# EasyEDA schematic ABCD_2020-09-23_12-41-30.json
TITLE: Sheet_1; REV: 1.2; Date: 2020-09-17; Sheet: 2/2; Drawn By: 刘宇帆; Company: 焊锡长隆
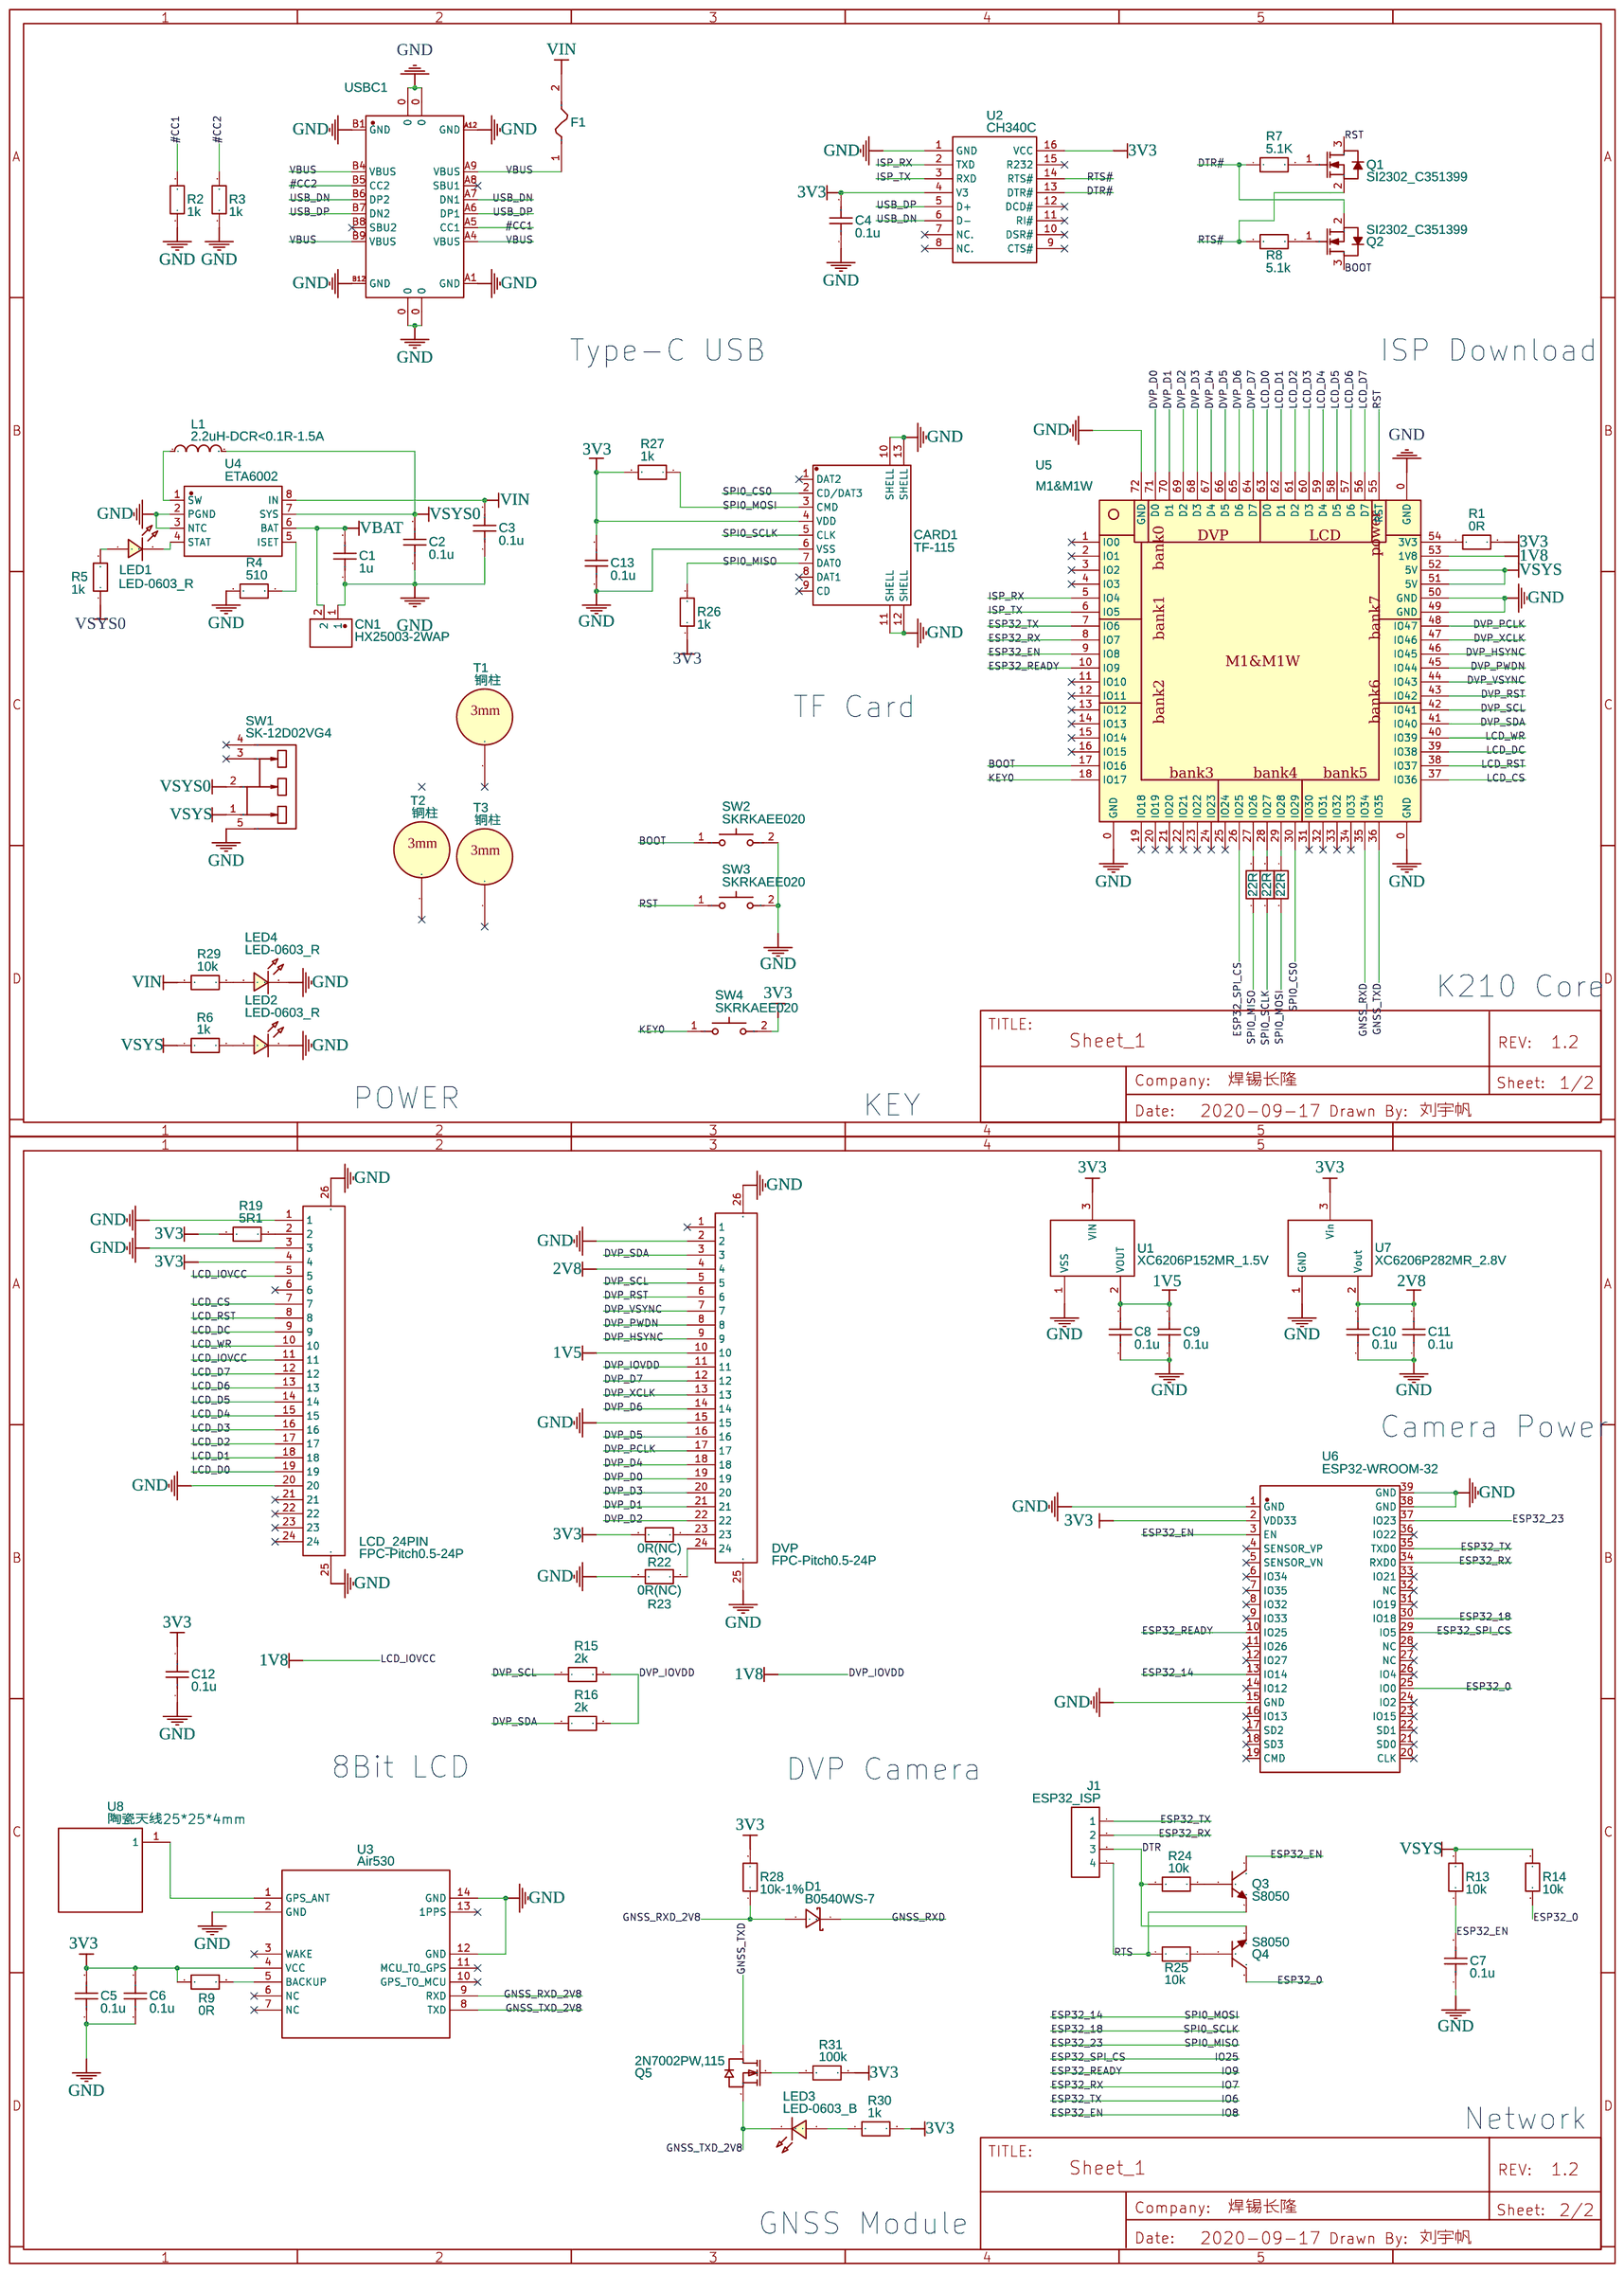
[diagram p0: schematic sheet]

## Parts
C1  1u  [C0603]
C2  0.1u  [C0805]
C3  0.1u  [C0805]
C4  0.1u  [C0603]
C5  0.1u  [C0603]
C6  0.1u  [C0603]
C7  0.1u  [C0603]
C8  0.1u  [C0603]
C9  0.1u  [C0603]
C10  0.1u  [C0603]
C11  0.1u  [C0603]
C12  0.1u  [C0603]
C13  0.1u  [C0603]
CARD1  TF-115  [TF-SMD_TF-115]
CN1  HX25003-2WAP  [CONN-TH_2P-P2.50_HX25003-2WAP]
D1  B0540WS-7  [SOD-323_L1.8-W1.3-LS2.5-RD]
DVP  FPC-Pitch0.5-24P  [FPC-SMD_24P-P0.50-FLIP-LOCK-BOTTOM-CONTACT]
F1  SMD0805-035  [F0805]
J1  ESP32_ISP  [HDR-M-2.54_1X4]
L1  2.2uH-DCR<0.1R-1.5A  [L0805]
LCD_24PIN  FPC-Pitch0.5-24P  [FPC-SMD_24P-P0.50-FLIP-LOCK-BOTTOM-CONTACT]
LED1  LED-0603_R  [LED0603_RED]
LED2  LED-0603_R  [LED0603_RED]
LED3  LED-0603_B  [LED0603_BLUE]
LED4  LED-0603_R  [LED0603_RED]
Q1  SI2302_C351399  [SOT-23-3_L3.0-W1.7-P0.95-LS2.9-BR]
Q2  SI2302_C351399  [SOT-23-3_L3.0-W1.7-P0.95-LS2.9-BR]
Q3  S8050  [SOT-23-3_L2.9-W1.3-P1.90-LS2.4-BR]
Q4  S8050  [SOT-23-3_L2.9-W1.3-P1.90-LS2.4-BR]
Q5  2N7002PW,115  [SOT-323-3_L2.0-W1.3-P1.30-LS2.1-BR]
R1  0R  [R0603]
R2  1k  [R0603]
R3  1k  [R0603]
R4  510  [R0603]
R5  1k  [R0603]
R6  1k  [R0603]
R7  5.1K  [R0603]
R8  5.1k  [R0603]
R9  0R  [R0603]
R10  22R  [R0402]
R11  22R  [R0402]
R12  22R  [R0402]
R13  10k  [R0603]
R14  10k  [R0603]
R15  2k  [R0603]
R16  2k  [R0603]
R19  5R1  [R0603]
R22  0R(NC)  [R0603]
R23  0R(NC)  [R0603]
R24  10k  [R0603]
R25  10k  [R0603]
R26  1k  [R0603]
R27  1k  [R0603]
R28  10k-1%  [R0603]
R29  10k  [R0603]
R30  1k  [R0603]
R31  100k  [R0603]
SW1  SK-12D02VG4  [SW-TH_SK-12D02VG4]
SW2  SKRKAEE020  [SW-SMD_L3.9-W3.0-P4.45]
SW3  SKRKAEE020  [SW-SMD_L3.9-W3.0-P4.45]
SW4  SKRKAEE020  [SW-SMD_L3.9-W3.0-P4.45]
T1  铜柱  [螺丝孔-3MM]
T2  铜柱  [螺丝孔-3MM]
T3  铜柱  [螺丝孔-3MM]
U1  XC6206P152MR_1.5V  [SOT-23-3_L2.9-W1.3-P1.90-LS2.4-BR]
U2  CH340C  [SOP-16_L10.0-W3.9-P1.27-LS6.0-BL]
U3  Air530  [AIR530]
U4  ETA6002  [ESOP-8_L4.9-W3.9-P1.27-LS6.0-BL-EP]
U5  M1&M1W  [M1&M1W(MODIFIED)]
U6  ESP32-WROOM-32  [WIFIM-SMD_39P-L25.5-W18.0-P1.27]
U7  XC6206P282MR_2.8V  [SOT-23-3_L2.9-W1.6-P1.90-LS2.8-BR]
U8  陶瓷天线25*25*4mm  [陶瓷天线25*25*4]
USBC1  TYPE-C 3.1 -16P_C168689  [USB-C-SMD_TYPE-C-USB-12]

## Library data of the parts
C1 C4-C13 = C_0603_US: Contributor: LCEDA_Lib
C2 C3 = C_0805_US: Contributor: LCEDA_Lib
CARD1 = TF-115: Supplier: LCSC; Supplier Part: C266620; Manufacturer: XUNPU; Contributor: LCSC
CN1 = HX25003-2WAP: Supplier: LCSC; Supplier Part: C442326; Manufacturer: HX(Zhejiang Yueqing Hongxing Elec); Contributor: LCSC
D1 = B0540WS-7: Supplier Part: C98664; Supplier: LCSC; Manufacturer: DIODES; Contributor: LCSC; LCSC Assembly: Yes; SMT Type: Extend
DVP LCD_24PIN = FPC-Pitch0.5-24P-Bottom-Contact-Flip-Lock: Supplier: LCSC; Manufacturer: BOOMELE; Supplier Part: C20688
F1 = SMD0805-035: Supplier: LCSC; Manufacturer: TECHFUSE; image: //image.lceda.cn/szlcsc/C70058.jpg; Supplier Part: C70058; LCSC Assembly: Yes; SMT Type: Extend
J1 = HDR-M-2.54_1x4: Supplier Part: C124378; Supplier: LCSC; Contributor: LCEDA_Lib
L1 = L0805_US: Contributor: LCEDA_Lib
LED1 LED2 LED4 = LED-0603_R: Manufacturer: EVERLIGHT(台湾亿光); Manufacturer Part: 19-217/R6C-AL1M2VY/3T; Supplier Part: C72044; Supplier: LCSC; Contributor: LCEDA_01
LED3 = LED-0603_B: Manufacturer: EVERLIGHT(台湾亿光); Manufacturer Part: 19-217/BHC-ZL1M2RY/3T; Supplier Part: C72041; Supplier: LCSC; Contributor: LCEDA_01
Q1 Q2 = SI2302_C351399: Supplier: LCSC; Supplier Part: C351399; Manufacturer: PUOLOP; Manufacturer Part: SI2302; Contributor: LCSC
Q3 Q4 = S8050-C139514: Supplier: LCSC; Manufacturer: Yenji; Contributor: 立创EDA官方封装库; Supplier Part: C139514
Q5 = 2N7002PW,115: Supplier: LCSC; Supplier Part: C255579; Manufacturer: Nexperia; Contributor: LCSC; LCSC Assembly: Yes; SMT Type: Extend
R1-R16 R19 R22-R31 = R_0603_EU: Contributor: LCEDA_Lib
SW1 = SK-12D02VG4: Supplier: LCSC; Supplier Part: C239529; Manufacturer: SOFNG; Contributor: LCSC
SW2-SW4 = SKRKAEE020: Supplier: LCSC; Manufacturer: ALPS; Supplier Part: C115357
T1-T3 = 铜柱: Contributor: liujiayu6388
U1 = XC6206P152MR_C424701: Supplier: LCSC; Supplier Part: C424701; Manufacturer: Torex Semicon; Manufacturer Part: XC6206P152MR; Contributor: LCSC
U2 = CH340C: Supplier: LCSC; Manufacturer: WCH; Supplier Part: C84681; LCSC Assembly: Yes; SMT Type: Extend
U3 = Air530: link: http://www.openluat.com/Product/gps/Air530.html; Contributor: libc0607
U4 = ETA6002: Manufacturer: 上海钰泰; Supplier: 上海钰泰; Contributor: Watching_The_Sky
U5 = M1&amp;M1W: Contributor: ZhangXiao
U6 = ESP32-WROOM-32: Supplier: LCSC; Supplier Part: C503587; Manufacturer: Espressif Systems; Contributor: LCSC
U7 = XC6206P282MR: Supplier: LCSC; Manufacturer: TOREX; image: //image.lceda.cn/szlcsc/C14255.jpg; Supplier Part: C14255; LCSC Assembly: Yes; SMT Type: Extend
U8 = 陶瓷天线25*25*4mm: Contributor: EAFJLDSKF
USBC1 = TYPE-C 3.1 -16P_C168689: Supplier: LCSC; Supplier Part: C168689; Manufacturer: LCSC; Contributor: 立创EDA官方封装库

## Nets
1V5: C8.2 C9.2 DVP.10 U1.2(VOUT)
1V8: DVP.11 LCD_24PIN.5 LCD_24PIN.11 R15.2 R16.2 U5.53(1V8)
2V8: C10.2 C11.2 DVP.4 U7.2(Vout)
3V3: C4.2 C5.2 C6.2 C12.2 C13.2 CARD1.4(VDD) LCD_24PIN.4 R1.2 R9.1 R19.1 R22.1 R26.1 R27.2 R28.2 R30.2 R31.2 SW4.2 U1.3(VIN) U2.4(V3) U2.16(VCC) U3.4(VCC) U6.2(VDD33) U7.3(Vin)
GND: C1.1 C2.1 C3.1 C4.1 C5.1 C6.1 C7.1 C8.1 C9.1 C10.1 C11.1 C12.1 C13.1 CARD1.6(VSS) CARD1.10(SHELL) CARD1.11(SHELL) CARD1.12(SHELL) CARD1.13(SHELL) CN1.1 DVP.2 DVP.15 DVP.25 DVP.26 LCD_24PIN.1 LCD_24PIN.3 LCD_24PIN.20 LCD_24PIN.25 LCD_24PIN.26 LED2.2 LED4.2 R2.1 R3.1 R4.1 R23.1 SW1.5 SW2.2 SW3.2 U1.1(VSS) U2.1(GND) U3.2(GND) U3.12(GND) U3.14(GND) U4.2(PGND) U4.3(NTC) U5.0(GND) U5.49(GND) U5.50(GND) U5.72(GND) U6.1(GND) U6.15(GND) U6.38(GND) U6.39(GND) U7.1(GND) USBC1.0 USBC1.A1(GND) USBC1.A12(GND) USBC1.B1(GND) USBC1.B12(GND)
VBAT: C1.2 CN1.2 U4.6(BAT)
VBUS: F1.1 USBC1.A4(VBUS) USBC1.A9(VBUS) USBC1.B4(VBUS) USBC1.B9(VBUS)
VIN: C3.2 F1.2 R29.1 U4.8(IN)
#CC1: R2.2 USBC1.A5(CC1)
#CC2: R3.2 USBC1.B5(CC2)
BOOT: Q2.3(D) SW2.1 U5.17(IO16)
DTR: J1.3 Q4.2(E) R24.1
DTR#: Q2.2(S) R7.1 U2.13(DTR#)
DVP_D0: DVP.19 U5.71(D0)
DVP_D1: DVP.21 U5.70(D1)
DVP_D2: DVP.22 U5.69(D2)
DVP_D3: DVP.20 U5.68(D3)
DVP_D4: DVP.18 U5.67(D4)
DVP_D5: DVP.16 U5.66(D5)
DVP_D6: DVP.14 U5.65(D6)
DVP_D7: DVP.12 U5.64(D7)
DVP_HSYNC: DVP.9 U5.46(IO45)
DVP_PCLK: DVP.17 U5.48(IO47)
DVP_PWDN: DVP.8 U5.45(IO44)
DVP_RST: DVP.6 U5.43(IO42)
DVP_SCL: DVP.5 R15.1 U5.42(IO41)
DVP_SDA: DVP.3 R16.1 U5.41(IO40)
DVP_VSYNC: DVP.7 U5.44(IO43)
DVP_XCLK: DVP.13 U5.47(IO46)
ESP32_0: Q4.3(C) R14.1 U6.25(IO0)
ESP32_14: CARD1.3(CMD) R12.2 R27.1 U6.13(IO14)
ESP32_18: CARD1.5(CLK) R11.1 U6.30(IO18)
ESP32_23: CARD1.7(DAT0) R10.1 R26.2 U6.37(IO23)
ESP32_EN: C7.2 Q3.3(C) R13.1 U5.9(IO8) U6.3(EN)
ESP32_READY: U5.10(IO9) U6.10(IO25)
ESP32_RX: J1.2 U5.8(IO7) U6.34(RXD0)
ESP32_SPI_CS: U5.26(IO25) U6.29(IO5)
ESP32_TX: J1.1 U5.7(IO6) U6.35(TXD0)
GNSS_RXD: D1.1(C) U5.35(IO34)
GNSS_RXD_2V8: D1.2(A) R28.1 U3.9(RXD)
GNSS_TXD: Q5.3(D) U5.36(IO35)
GNSS_TXD_2V8: LED3.2 Q5.2(S) U3.8(TXD)
ISP_RX: U2.2(TXD) U5.5(IO4)
ISP_TX: U2.3(RXD) U5.6(IO5)
KEY0: SW4.1 U5.18(IO17)
LCD_CS: LCD_24PIN.7 U5.37(IO36)
LCD_D0: LCD_24PIN.19 U5.63(D0)
LCD_D1: LCD_24PIN.18 U5.62(D1)
LCD_D2: LCD_24PIN.17 U5.61(D2)
LCD_D3: LCD_24PIN.16 U5.60(D3)
LCD_D4: LCD_24PIN.15 U5.59(D4)
LCD_D5: LCD_24PIN.14 U5.58(D5)
LCD_D6: LCD_24PIN.13 U5.57(D6)
LCD_D7: LCD_24PIN.12 U5.56(D7)
LCD_DC: LCD_24PIN.9 U5.39(IO38)
LCD_RST: LCD_24PIN.8 U5.38(IO37)
LCD_WR: LCD_24PIN.10 U5.40(IO39)
RST: Q1.3(D) SW3.1 U5.55(RST)
RTS: J1.4 Q3.2(E) R25.1
RTS#: Q1.2(S) R8.1 U2.14(RTS#)
SPI0_CS0: CARD1.2(CD/DAT3) U5.30(IO29)
USB_DN: U2.6(D-) USBC1.A7(DN1) USBC1.B6(DP2)
USB_DP: U2.5(D+) USBC1.A6(DP1) USBC1.B7(DN2)
VSYS: R6.1 R13.2 R14.2 SW1.1 U5.51(5V) U5.52(5V)
VSYS0: C2.2 L1.2 R5.1 SW1.2 U4.7(SYS)
Net-(DVP-23): DVP.23 R22.2
Net-(DVP-24): DVP.24 R23.2
Net-(L1-1): L1.1 U4.1(SW)
Net-(LCD_24PIN-2): LCD_24PIN.2 R19.2
Net-(LED1-1): LED1.1 R5.2
Net-(LED1-2): LED1.2 U4.4(STAT)
Net-(LED2-1): LED2.1 R6.2
Net-(LED3-1): LED3.1 R30.1
Net-(LED4-1): LED4.1 R29.2
Net-(Q1-1): Q1.1(G) R7.2
Net-(Q2-1): Q2.1(G) R8.2
Net-(Q3-1): Q3.1(B) R24.2
Net-(Q4-1): Q4.1(B) R25.2
Net-(Q5-1): Q5.1(G) R31.1
Net-(R1-1): R1.1 U5.54(3V3)
Net-(R4-2): R4.2 U4.5(ISET)
Net-(R9-2): R9.2 U3.5(BACKUP)
Net-(R10-2): R10.2 U5.27(IO26)
Net-(R11-2): R11.2 U5.28(IO27)
Net-(R12-1): R12.1 U5.29(IO28)
Net-(U3-1): U3.1(GPS_ANT) U8.1

Not connected (* = marked no-connect by the designer): CARD1 1(DAT2)* 8(DAT1)* 9(CD)*; DVP 1*; LCD_24PIN 6* 21* 22* 23* 24*; SW1 3* 4*; T1 1*; T2 1*; T3 1*; U2 7(NC.)* 8(NC.)* 9(CTS#)* 10(DSR#)* 11(RI#)* 12(DCD#)* 15(R232)*; U3 3(WAKE)* 6(NC)* 7(NC)* 10(GPS_TO_MCU)* 11(MCU_TO_GPS)* 13(1PPS)*; U5 1(IO0)* 2(IO1)* 3(IO2)* 4(IO3)* 11(IO10)* 12(IO11)* 13(IO12)* 14(IO13)* 15(IO14)* 16(IO15)* 19(IO18)* 20(IO19)* 21(IO20)* 22(IO21)* 23(IO22)* 24(IO23)* 25(IO24)* 31(IO30)* 32(IO31)* 33(IO32)* 34(IO33)*; U6 4(SENSOR_VP)* 5(SENSOR_VN)* 6(IO34)* 7(IO35)* 8(IO32)* 9(IO33)* 11(IO26)* 12(IO27)* 14(IO12)* 16(IO13)* 17(SD2)* 18(SD3)* 19(CMD)* 20(CLK)* 21(SD0)* 22(SD1)* 23(IO15)* 24(IO2)* 26(IO4)* 27(NC)* 28(NC)* 31(IO19)* 32(NC)* 33(IO21)* 36(IO22)*; USBC1 A8(SBU1)* B8(SBU2)*

## Notes on the sheet
- Type-C USB
- ISP Download
- TF Card
- K210 Core
- POWER
- KEY
- Camera Power
- 8Bit LCD
- DVP Camera
- Network
- GNSS Module
